# Altium schematic sheet Controller.SchDoc
size A3; SheetNumber: 3; SheetTotal: 3
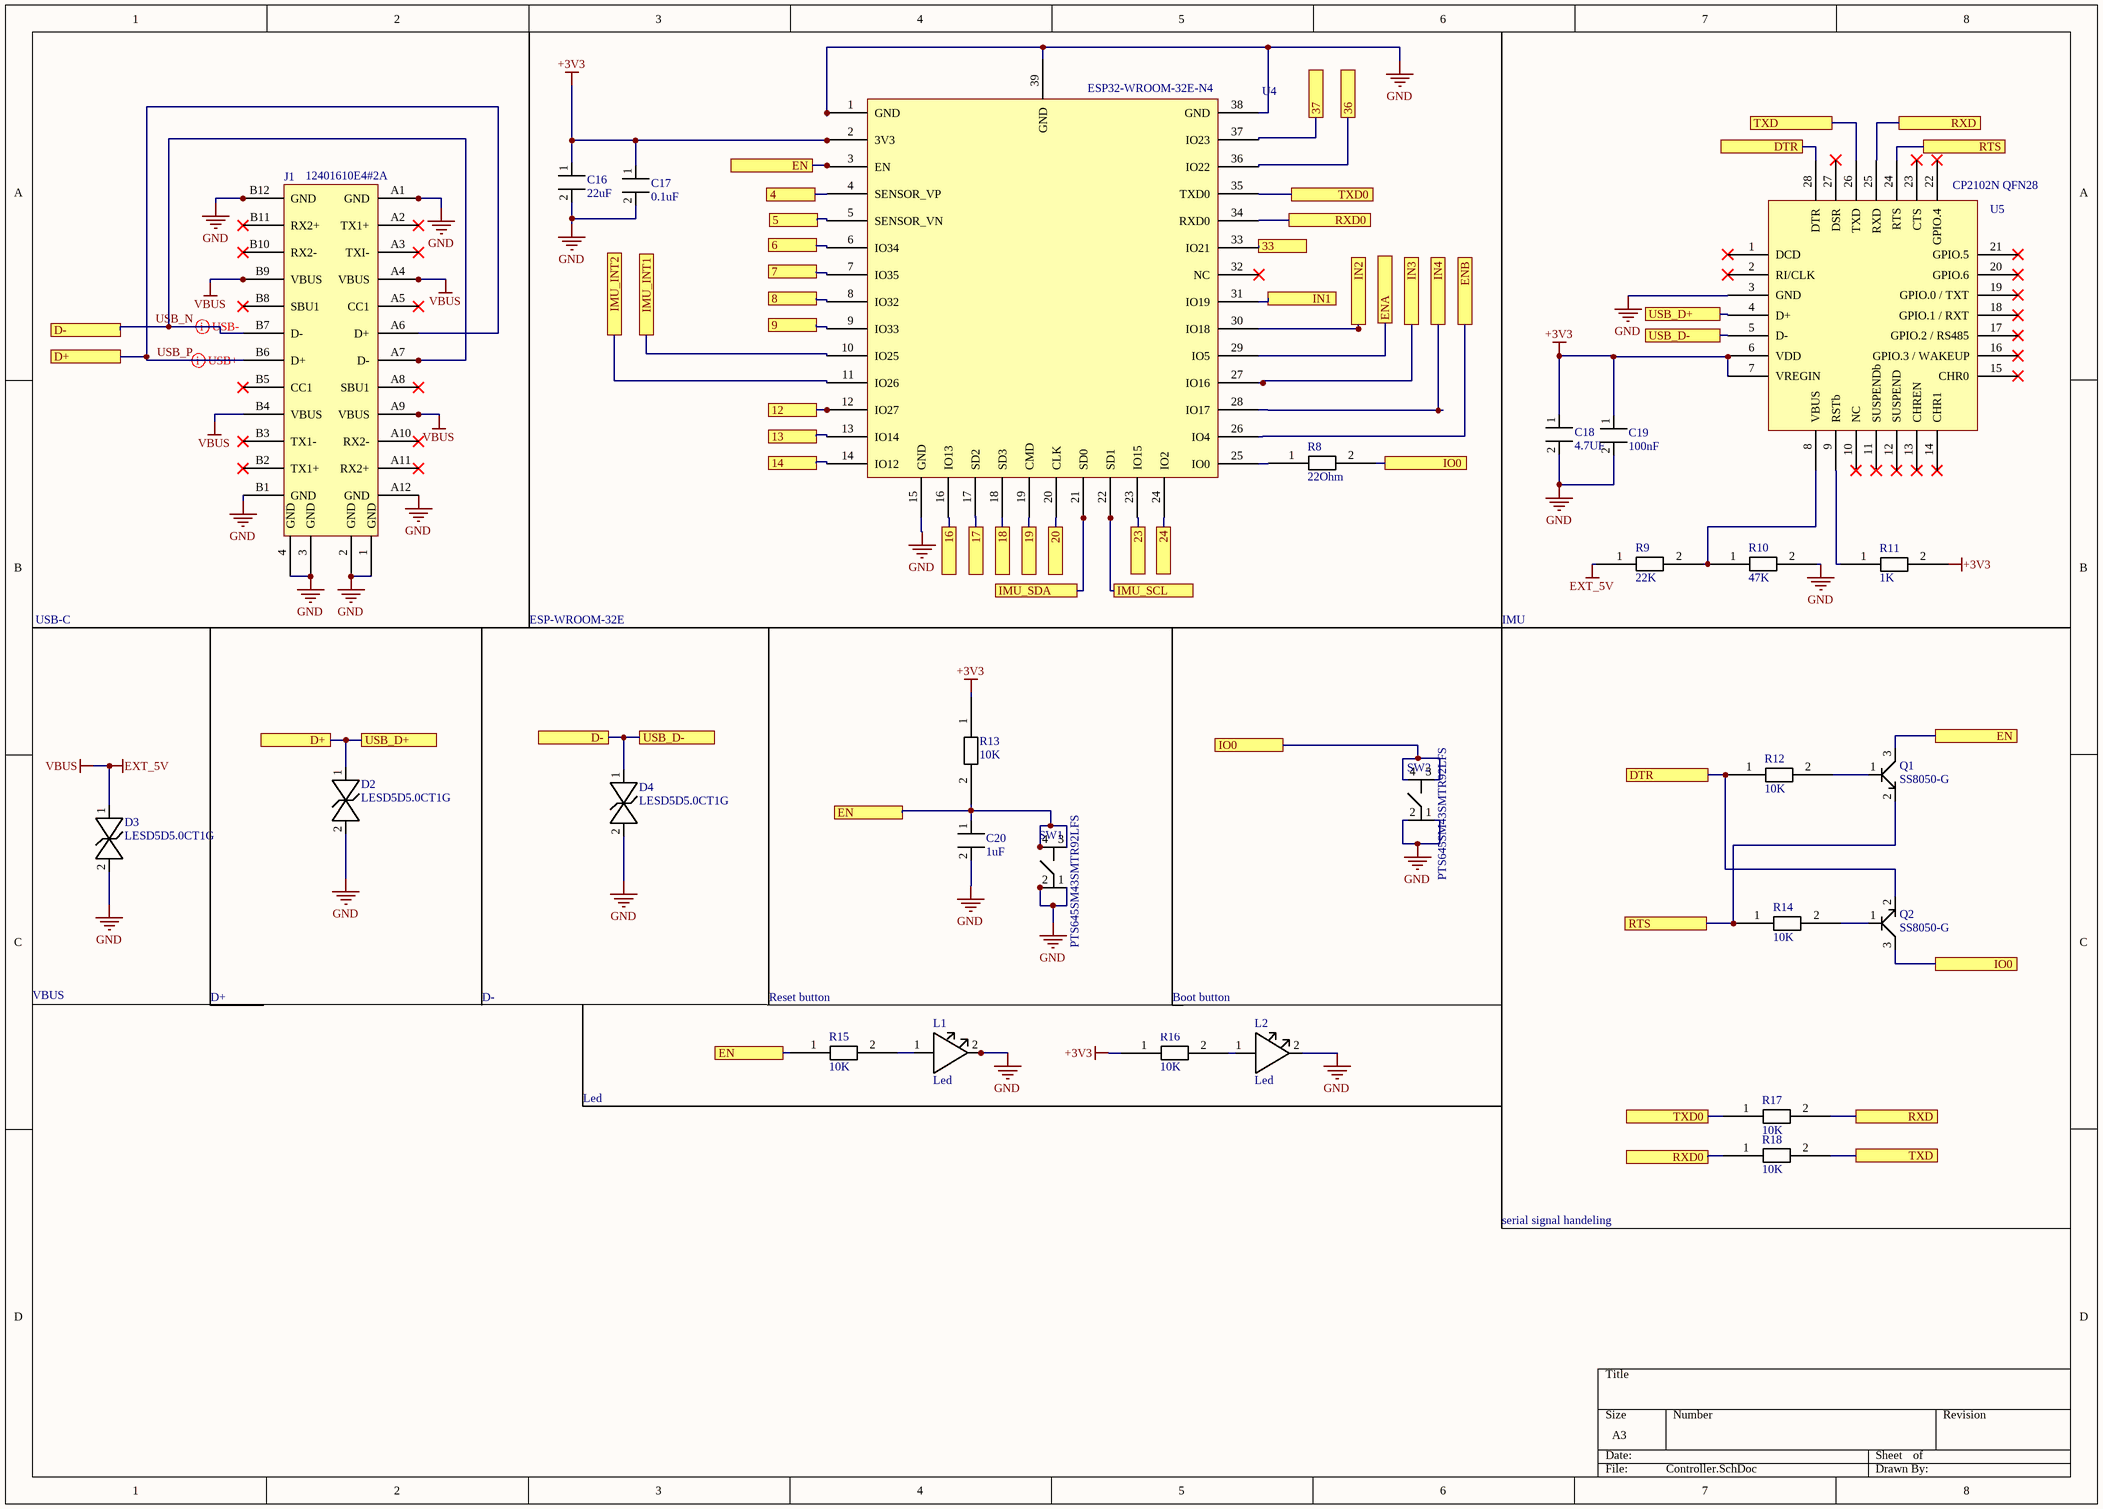
[diagram p0: Controller.SchDoc]

## Parts
C16  22uF  [Condo]
C17  0.1uF  [Condo]
C18  4.7UF  [Condo]
C19  100nF  [Condo]
C20  1uF  [Condo]
D2  LESD5D5.0CT1G  [LESD5D5.0CT1G]
D3  LESD5D5.0CT1G  [LESD5D5.0CT1G]
D4  LESD5D5.0CT1G  [LESD5D5.0CT1G]
J1  12401610E4#2A  [105450-0101]
L1  Led  [LED]
L2  Led  [LED]
Q1  SS8050-G  [SS8050-G]
Q2  SS8050-G  [SS8050-G]
R8  22Ohm  [Resistor]
R9  22K  [Resistor]
R10  47K  [Resistor]
R11  1K  [Resistor]
R12  10K  [Resistor]
R13  10K  [Resistor]
R14  10K  [Resistor]
R15  10K  [Resistor]
R16  10K  [Resistor]
R17  10K  [Resistor]
R18  10K  [Resistor]
SW1  PTS645SM43SMTR92LFS  [PTS645SM43SMTR92LFS]
SW2  PTS645SM43SMTR92LFS  [PTS645SM43SMTR92LFS]
U4  ESP32-WROOM-32E-N4  [ESP32-WROOM-32E]
U5  CP2102N QFN28  [cp2102]

## Ports
4 (see Peripherals[1C]), 5 (see Peripherals[1C]), 6 (see Peripherals[1C]), 7 (see Peripherals[1C]), 8 (see Peripherals[1C]), 9 (see Peripherals[1C]), 12 (see Peripherals[1C]), 13 (see Peripherals[1C]), 14 (see Peripherals[1C]), 16 (see Peripherals[1C]), 17 (see Peripherals[1C]), 18 (see Peripherals[1C]), 19 (see Peripherals[2C]), 20 (see Peripherals[2C]), 23 (see Peripherals[2C]), 24 (see Peripherals[2C]), 33 (see Peripherals[2C]), 36 (see Peripherals[2C]), 37 (see Peripherals[2C]), D+ (see Controller[1A]), D+ (see Controller[1B]), D- (see Controller[1A]), D- (see Controller[3B]), DTR (see Controller[7A]), DTR (see Controller[7C]), EN (see Controller[3A], Controller[3C], Controller[4C]), EN (see Controller[3A], Controller[3C], Controller[8B]), EN (see Controller[3A], Controller[4C], Controller[8B]), EN (see Controller[3C], Controller[4C], Controller[8B]), ENA (see Peripherals[4C]), ENB (see Peripherals[4C]), IMU_INT1 (see Peripherals[3B]), IMU_INT2 (see Peripherals[4B]), IMU_SCL (see Peripherals[4A]), IMU_SDA (see Peripherals[4A]), IN1 (see Peripherals[4C]), IN2 (see Peripherals[4C]), IN3 (see Peripherals[4C]), IN4 (see Peripherals[4C]), IO0 (see Controller[5B], Controller[6B]), IO0 (see Controller[5B], Controller[8C]), IO0 (see Controller[6B], Controller[8C]), RTS (see Controller[7C]), RTS (see Controller[8A]), RXD0 (see Controller[5A]), RXD0 (see Controller[7D]), RXD (see Controller[8A]), RXD (see Controller[8C]), TXD0 (see Controller[5A]), TXD0 (see Controller[7C]), TXD (see Controller[7A]), TXD (see Controller[8D]), USB_D+ (see Controller[2B]), USB_D+ (see Controller[7A]), USB_D- (see Controller[3B]), USB_D- (see Controller[7A])

## Nets
+3V3: C16.1(IN) C17.1(IN) C18.1(IN) C19.1(IN) R11.2 R13.1 R16.1 U4.2(3V3) U5.6(VDD) U5.7(VREGIN)
EXT_5V: D3.1(vcc) J1.A4(VBUS) J1.A9(VBUS) J1.B4(VBUS) J1.B9(VBUS) R9.1  [also labelled VBUS]
GND: C16.2(OUT) C17.2(OUT) C18.2(OUT) C19.2(OUT) C20.2(OUT) D2.2(gnd) D3.2(gnd) D4.2(gnd) J1.1(GND) J1.2(GND) J1.3(GND) J1.4(GND) J1.A1(GND) J1.A12(GND) J1.B1(GND) J1.B12(GND) L1.2 L2.2 R10.2 SW1.1 SW1.2 SW2.1 SW2.2 U4.1(GND) U4.15(GND) U4.38(GND) U4.39(GND) U5.3(GND)
4: U4.4(SENSOR_VP) ; port 4
5: U4.5(SENSOR_VN) ; port 5
6: U4.6(IO34) ; port 6
7: U4.7(IO35) ; port 7
8: U4.8(IO32) ; port 8
9: U4.9(IO33) ; port 9
12: U4.12(IO27) ; port 12
13: U4.13(IO14) ; port 13
14: U4.14(IO12) ; port 14
16: U4.16(IO13) ; port 16
17: U4.17(SD2) ; port 17
18: U4.18(SD3) ; port 18
19: U4.19(CMD) ; port 19
20: U4.20(CLK) ; port 20
23: U4.23(IO15) ; port 23
24: U4.24(IO2) ; port 24
33: U4.33(IO21) ; port 33
36: U4.36(IO22) ; port 36
37: U4.37(IO23) ; port 37
DTR: Q2.2 R12.1 U5.28(DTR) ; port DTR
EN: C20.1(IN) Q1.3 R13.2 R15.1 SW1.3 SW1.4 U4.3(EN) ; port EN
ENA: U4.29(IO5) ; port ENA
ENB: U4.26(IO4) ; port ENB
IMU_INT1: U4.10(IO25) ; port IMU_INT1
IMU_INT2: U4.11(IO26) ; port IMU_INT2
IMU_SCL: U4.22(SD1) ; port IMU_SCL
IMU_SDA: U4.21(SD0) ; port IMU_SDA
IN1: U4.31(IO19) ; port IN1
IN2: U4.30(IO18) ; port IN2
IN3: U4.27(IO16) ; port IN3
IN4: U4.28(IO17) ; port IN4
IO0: Q2.3 R8.2 SW2.3 SW2.4 ; port IO0
RTS: Q1.2 R14.1 U5.24(RTS) ; port RTS
RXD: R17.2 U5.25(RXD) ; port RXD
RXD0: R18.1 U4.34(RXD0) ; port RXD0
TXD: R18.2 U5.26(TXD) ; port TXD
TXD0: R17.1 U4.35(TXD0) ; port TXD0
USB_N: D4.1(vcc) J1.A7(D-) J1.B7(D-) U5.5(D-) ; port USB_D-, port D-
USB_P: D2.1(vcc) J1.A6(D+) J1.B6(D+) U5.4(D+) ; port USB_D+, port D+
NetL1_1: L1.1 R15.2
NetL2_1: L2.1 R16.2
NetQ1_1: Q1.1 R12.2
NetQ2_1: Q2.1 R14.2
NetR8_1: R8.1 U4.25(IO0)
NetR9_2: R9.2 R10.1 U5.8(VBUS)
NetR11_1: R11.1 U5.9(RSTb)

Not connected (* = marked no-connect by the designer): J1 A2(TX1+)* A3(TXI-)* A5(CC1)* A8(SBU1)* A10(RX2-)* A11(RX2+)* B2(TX1+)* B3(TX1-)* B5(CC1)* B8(SBU1)* B10(RX2-)* B11(RX2+)*; U4 32(NC)*; U5 1(DCD)* 2(RI/CLK)* 10(NC)* 11(SUSPENDb)* 12(SUSPEND)* 13(CHREN)* 14(CHR1)* 15(CHR0)* 16(GPIO.3_/_WAKEUP)* 17(GPIO.2_/_RS485)* 18(GPIO.1_/_RXT)* 19(GPIO.0_/_TXT)* 20(GPIO.6)* 21(GPIO.5)* 22(GPIO.4)* 23(CTS)* 27(DSR)*

## Layout directives
differential pair; differential pair class USB: USB_N, USB_P

## Notes on the sheet
- USB-C
- ESP-WROOM-32E
- IMU
- VBUS
- D+
- D-
- (near R15) Reset button
- Boot button
- Led
- serial signal handeling

## Library data of the parts
C16-C20 = CAPA
R8-R18 = Resistor